# Altium project BLDC_Motor_Reversal_Rev2.PrjPcb
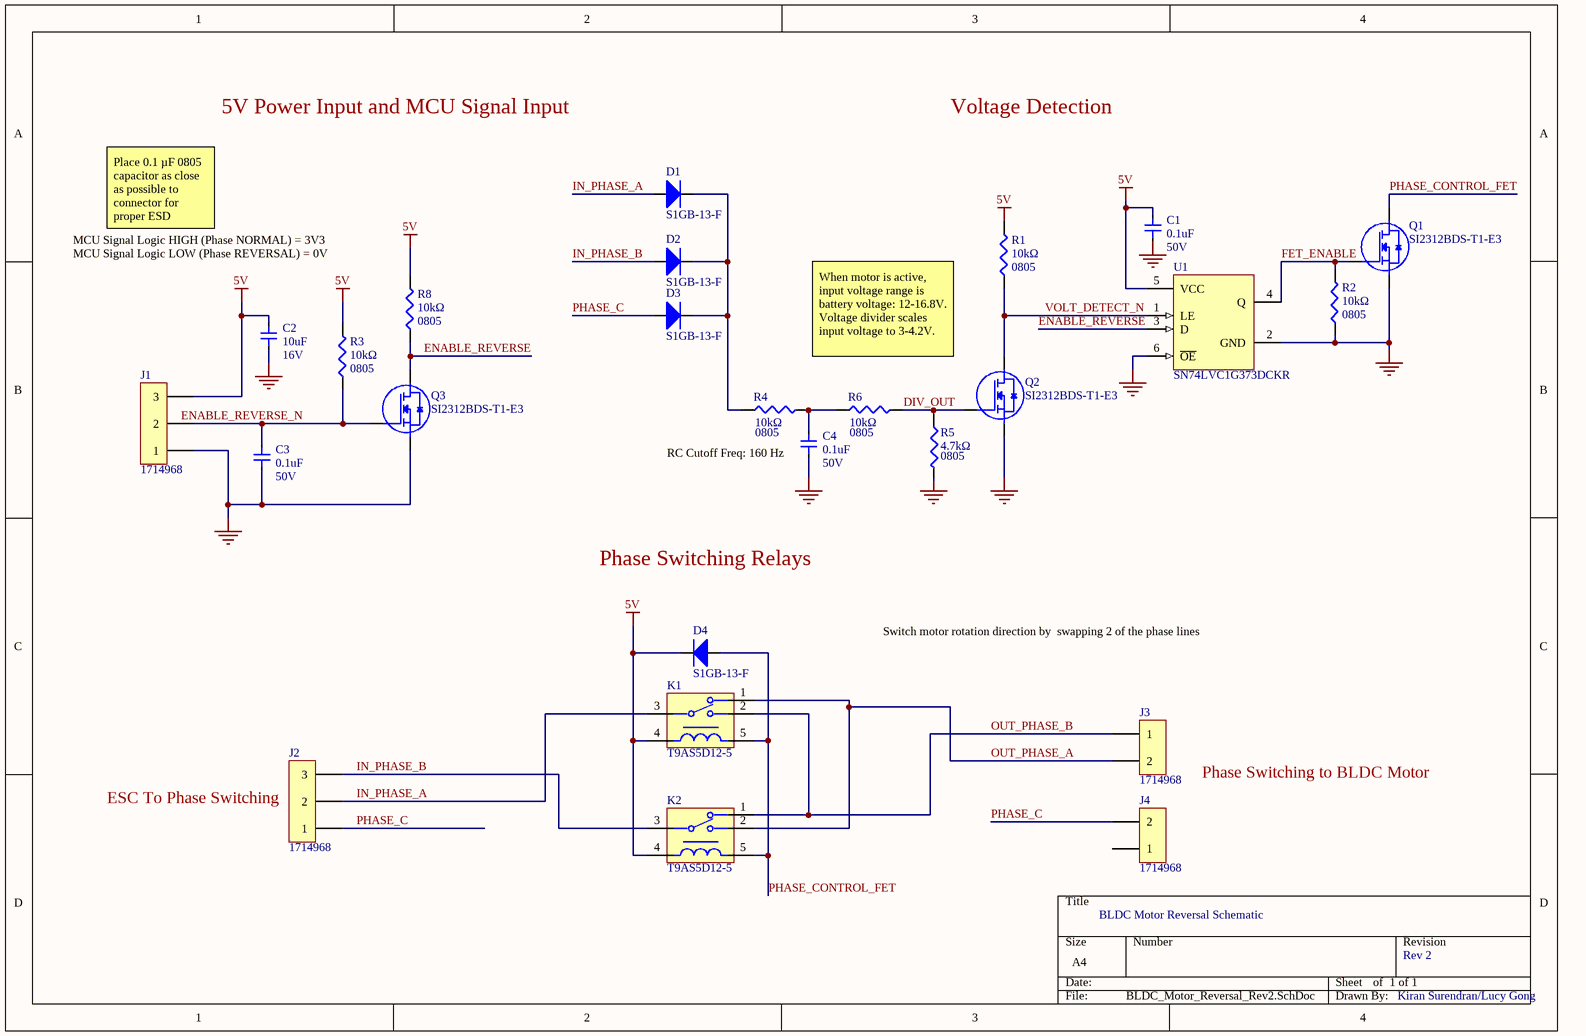
[diagram p0: BLDC_Motor_Reversal_Rev2.SchDoc]
1 sheet, 25 parts. Net scope: global (net labels, ports and power ports of the same name join across sheets).
Board file: BLDC_Motor_Reversal_Rev2.PcbDoc

## Sheet BLDC_Motor_Reversal_Rev2.SchDoc
size A4; SheetNumber: 1; SheetTotal: 1

### Parts
C1  Voltage Rating: 50V  Capacitance: 0.1uF  [C0805C104K5RACTU]  (hidden comment: C0805C104K5RACTU)
C2  Voltage Rating: 16V  Capacitance: 10uF  [C0805C106K4PACTU]  (hidden comment: C0805C106K4PACTU)
C3  Voltage Rating: 50V  Capacitance: 0.1uF  [C0805C104K5RACTU]  (hidden comment: C0805C104K5RACTU)
C4  Voltage Rating: 50V  Capacitance: 0.1uF  [C0805C104K5RACTU]  (hidden comment: C0805C104K5RACTU)
D1  S1GB-13-F  [S1GB-13-F]
D2  S1GB-13-F  [S1GB-13-F]
D3  S1GB-13-F  [S1GB-13-F]
D4  S1GB-13-F  [S1GB-13-F]
J1  1714968  [796740-3]
J2  1714968  [796740-3]
J3  1714968  [1714955]
J4  1714968  [1714955]
K1  T9AS5D12-5  [T9AS5D12-5]
K2  T9AS5D12-5  [T9AS5D12-5]
Q1  SI2312BDS-T1-E3  [SI2312BDS-T1-E3]
Q2  SI2312BDS-T1-E3  [SI2312BDS-T1-E3]
Q3  SI2312BDS-T1-E3  [SI2312BDS-T1-E3]
R1  Package: 0805  Resistance: 10kΩ  [RC0805JR-0710KL]  (hidden comment: RC0805JR-0710KL)
R2  Package: 0805  Resistance: 10kΩ  [RC0805JR-0710KL]  (hidden comment: RC0805JR-0710KL)
R3  Package: 0805  Resistance: 10kΩ  [RC0805JR-0710KL]  (hidden comment: RC0805JR-0710KL)
R4  Package: 0805  Resistance: 10kΩ  [RC0805JR-0710KL]  (hidden comment: RC0805JR-0710KL)
R5  Package: 0805  Resistance: 4.7kΩ  [RC0805JR-0747KL]  (hidden comment: RC0805JR-0747KL)
R6  Package: 0805  Resistance: 10kΩ  [RC0805JR-0710KL]  (hidden comment: RC0805JR-0710KL)
R8  Package: 0805  Resistance: 10kΩ  [RC0805JR-0710KL]  (hidden comment: RC0805JR-0710KL)
U1  SN74LVC1G373DCKR  [DCK0006A_N]

### Nets
5V: C1.2 C2.2 D4.1(-) J1.3 K1.4 K2.4 R1.2 R3.2 R8.2 U1.5(VCC)
GND: C1.1 C2.1 C3.1 C4.1 J1.1 Q1.2(Source) Q2.2(Source) Q3.2(Source) R2.1 R5.2 U1.2(GND) U1.6(~{OE})
DIV_OUT: Q2.1(Gate) R5.1 R6.2
ENABLE_REVERSE: Q3.3(Drain) R8.1 U1.3(D)
FET_ENABLE: Q1.1(Gate) R2.2 U1.4(Q)
IN_PHASE_A: D1.1(+) J2.2 K1.3(COM)
IN_PHASE_B: D2.1(+) J2.3 K2.3(COM)
OUT_PHASE_A: J3.2 K1.1(NC) K2.2(NO)
OUT_PHASE_B: J3.1 K1.2(NO) K2.1(NC)
PHASE_C: D3.1(+) J2.1 J4.2
PHASE_CONTROL_FET: D4.2(+) K1.5 K2.5 Q1.3(Drain)
VOLT_DETECT_N: Q2.3(Drain) R1.1 U1.1(LE)
NetC3_2: C3.2 J1.2 Q3.1(Gate) R3.1
NetC4_2: C4.2 R4.2 R6.1
NetD1_2: D1.2(-) D2.2(-) D3.2(-) R4.1

Not connected (* = marked no-connect by the designer): J4 1

### Notes on the sheet
- 5V Power Input and MCU Signal Input
- Voltage Detection
- MCU Signal Logic HIGH (Phase NORMAL) = 3V3
- Place 0.1 µF 0805 capacitor as close as possible to connector for proper ESD protection
- MCU Signal Logic LOW (Phase REVERSAL) = 0V
- (near Q2) When motor is active, input voltage range is battery voltage: 12-16.8V. Voltage divider scales input voltage to 3-4.2V.
- (near C4) RC Cutoff Freq: 160 Hz
- Phase Switching Relays
- Switch motor rotation direction by
  swapping 2 of the phase lines
- Phase Switching to BLDC Motor
- (near J2) ESC To Phase Switching
- BLDC Motor Reversal Schematic
- 1 of 1
- Rev 2
- Kiran Surendran/Lucy Gong
- Labels drawn without touching a wire or pin: ENABLE_REVERSE_N

### Library data of the parts
C1 C3 C4 = C0805C104K5RACTU: CAP CER 0.1UF 50V X7R 0805; Manufacturer 1: KEMET; Manufacturer Part Number 1: C0805C104K5RACTU; Case/Package: 0805; Supplier 1: Digi-Key; Supplier Part Number 1: 399-1170-1-ND
C2 = C0805C106K4PACTU: CERAMIC CAPACITOR, 10UF, 16V, X5R, 10%, 0805; Manufacturer 1: KEMET; Supplier 1: Digi-Key; Supplier Part Number 1: 399-8012-1-ND; Manufacturer Part Number 1: C0805C106K4PACTU; Case/Package: 0805
D1-D3 = S1GB-13-F: Flyback Diode for SPDT; Manufacturer 1: Diodes Incorporated; VRRM: 325V; IFSM: 8.0A; Manufacturer Part Number 1: S1GB-13-F; Supplier 1: Digi-Key; Supplier Part Number 1: S1GB-FDICT-ND
D4 = S1GB-13-F: DIODE GEN PURP 400V 1A SMB; Manufacturer 1: Diodes Incorporated; VRRM: 325V; IFSM: 8.0A; Manufacturer Part Number 1: S1GB-13-F; Supplier 1: Digi-Key; Supplier Part Number 1: S1GB-FDICT-ND
J1 J2 = 1714968: TERM BLK 3P SIDE ENT 6.35MM PCB; Manufacturer 1: Phoenix Contact; Supplier Part Number 1: 277-1270-ND; Manufacturer Part Number 1: 1714968; Supplier 1: Digi-Key
J3 J4 = 1714955: TERM BLK 2P SIDE ENT 6.35MM PCB; Manufacturer: Phoenix Contact; Current Rating: 30A; Voltage Rating: 300V; Supplier 1: Digi-Key; Supplier Part Number 1: 277-1269-ND; Manufacturer Part Number: 1714968
K1 K2 = T9AS5D12-5: RELAY GEN PURPOSE SPDT 20A 5V; Manufacturer 1: TE Connectivity Potter & Brumfield Relays; Contact Voltage Rating (AC): 277V; Current Rating: 30A; Coil Current: 200mA; Voltage Rating (DC): 5V; Coil Voltage (DC): 5V; Contact Current Rating: 20A; Manufacturer Part Number 1: T9AS5D12-5; Supplier 1: Digi-Key; Supplier Part Number 1: T9AS5D12-5-ND
Q1 = SI2312BDS-T1-E3: MOSFET; Manufacturer 1: Vishay Siliconix; Manufacturer Part Number 1: SI2312BDS-T1-E3; Supplier 1: Digi-Key; Supplier Part Number 1: SI2312BDS-T1-E3CT-ND
Q2 Q3 = SI2312BDS-T1-E3: MOSFET N-CH 20V 3.9A SOT23-3; Manufacturer 1: Vishay Siliconix; Manufacturer Part Number 1: SI2312BDS-T1-E3; Supplier 1: Digi-Key; Supplier Part Number 1: SI2312BDS-T1-E3CT-ND
R1-R4 R6 R8 = RC0805JR-0710KL: RES SMD 10K OHM 5% 1/8W 0805; Manufacturer 1: Yageo; Supplier 1: Digi-Key; Supplier Part Number 1: 311-10KARCT-ND; Manufacturer Part Number 1: RC0805JR-0710KL; Tolerance: 5%
R5 = RC0805JR-074K7L: RES SMD 4.7K OHM 5% 1/8W 0805; Manufacturer 1: Yageo; Manufacturer Part Number 1: RC0805JR-074K7L; Supplier Part Number 1: 311-4.7KARTR-ND; Supplier 1: Digi-Key
U1 = SN74LVC1G373DCKR: IC LTCH D-TYP SGL 3-OUT SC70-6; Manufacturer: Texas Instruments; Max Supply Voltage: 5.5V; Min Supply Voltage: 1.65V; Polarity: Non-Inverting; Number of Bits: 1; Propagation Delay: 4ns; Quiescent Current: 10uA; Low Level Output Current: 32mA; Turn-On Delay Time: 1ns; High Level Output Current: -32mA; Logic Function: D-Type,Latch; Output Type: 3-STATE; Operating Supply Voltage: 3.3V; Supplier 1: Digi-Key; Manufacturer Part Number: SN74LVC1G373DCKR; RoHS: Yes; Category: Logic Gates; Stock 1: 1019; Pricing 1: 1=0.40000, 10=0.32400, 25=0.29640, 100=0.22050, 250=0.19980, 500=0.16536, 1000=0.12402 (USD); Mount: Surface Mount; Case/Package: SC; Number of Pins: 6; Weight: 8.8E-05oz; Contact Plating: Gold; Min Operating Temperature: -40°C; Max Operating Temperature: 125°C; Package Quantity: 3000; Packaging: Tape and Reel; Number of Elements: 1; Number of Circuits: 1; Number of Output Lines: 1; Number of Input Lines: 1; Number of Gates: 1; Independent Circuits: 1; Series: 74LVC; Technology: CMOS; Output Current: 32mA; Number of Channels: 1; Termination: SMD/SMT; Length: 2.15mm; Width: 1.4mm; Height: 1mm; Radiation Hardening: No; Lead Free: Lead Free; REACH SVHC: No SVHC; ComponentLink1URL: https://datasheet.ciiva.com/14288/sn74lvc1g373-14288210.pdf?src-supplier=Avnet; ComponentLink1Description: https://datasheet.ciiva.com/14288/sn74lvc1g373-14288210.pdf?src-supplier=Avnet; ComponentLink2URL: https://datasheet.ciiva.com/15088/getdatasheetpartid-416701-15088509.pdf?src-supplier=Verical; ComponentLink2Description: https://datasheet.ciiva.com/15088/getdatasheetpartid-416701-15088509.pdf?src-supplier=Verical; ComponentLink3URL: https://datasheet.ciiva.com/23782/1634225-23782997.pdf?src-supplier=Newark; ComponentLink3Description: https://datasheet.ciiva.com/23782/1634225-23782997.pdf?src-supplier=Newark; ComponentLink4URL: https://datasheet.ciiva.com/1881/sn74lvc1g373-1881421.pdf?src-supplier=Digi-Key; ComponentLink4Description: https://datasheet.ciiva.com/1881/sn74lvc1g373-1881421.pdf?src-supplier=Digi-Key; ComponentLink5URL: https://datasheet.ciiva.com/1881/sn74lvc1g373-1881422.pdf?src-supplier=Digi-Key; ComponentLink5Description: https://datasheet.ciiva.com/1881/sn74lvc1g373-1881422.pdf?src-supplier=Digi-Key; ComponentLink6URL: https://datasheet.ciiva.com/1881/sn74lvc1g373-1881423.pdf?src-supplier=Digi-Key; ComponentLink6Description: https://datasheet.ciiva.com/1881/sn74lvc1g373-1881423.pdf?src-supplier=Digi-Key; ComponentLink7URL: https://datasheet.ciiva.com/14288/sn74lvc1g373-14288214.pdf?src-supplier=Avnet; ComponentLink7Description: https://datasheet.ciiva.com/14288/sn74lvc1g373-14288214.pdf?src-supplier=Avnet; ComponentLink8URL: https://datasheet.ciiva.com/1508/1836498-1508503.pdf?src-supplier=Element14; ComponentLink8Description: https://datasheet.ciiva.com/1508/1836498-1508503.pdf?src-supplier=Element14; ComponentLink9URL: https://datasheet.ciiva.com/1508/1836498-1508504.pdf?src-supplier=Element14; ComponentLink9Description: https://datasheet.ciiva.com/1508/1836498-1508504.pdf?src-supplier=Element14; Supplier Part Number 1: 296-18775-1-ND